# Altium schematic sheet sch_pet.SchDoc
size A4; SheetNumber: 1; SheetTotal: 1
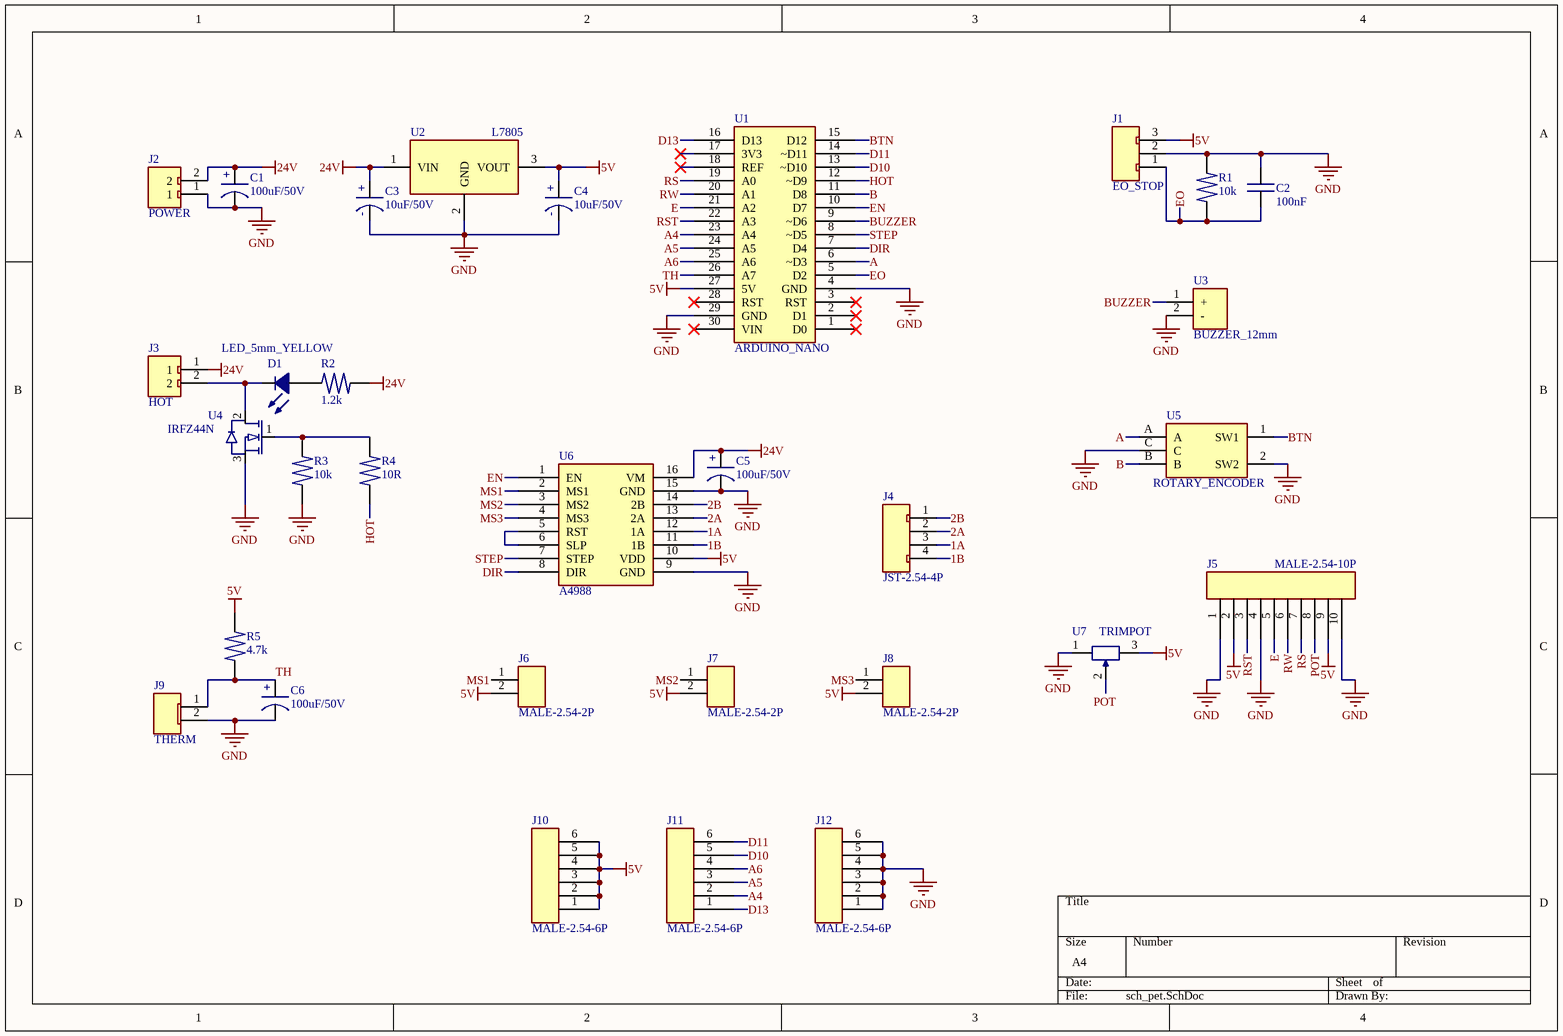
[diagram p0: sch_pet.SchDoc]

## Parts
C1  100uF/50V  [100uF/50V]
C2  100nF  [CAPACITOR 104]
C3  10uF/50V  [10uF/50V]
C4  10uF/50V  [10uF/50V]
C5  100uF/50V  [100uF/50V]
C6  100uF/50V  [100uF/50V]
D1  LED_5mm_YELLOW  [LED_5mm_YELLOW]
J1  EO_STOP  [JST-2.54-3P]
J2  POWER  [BORNE-5.00-2P]
J3  HOT  [BORNE-5.00-2P]
J4  JST-2.54-4P  [JST-2.54-4P]
J5  MALE-2.54-10P  [MALE-2.54-10P]
J6  MALE-2.54-2P  [MALE-2.54-2P]
J7  MALE-2.54-2P  [MALE-2.54-2P]
J8  MALE-2.54-2P  [MALE-2.54-2P]
J9  THERM  [JST-2.54-2P]
J10  MALE-2.54-6P  [MALE-2.54-6P]
J11  MALE-2.54-6P  [MALE-2.54-6P]
J12  MALE-2.54-6P  [MALE-2.54-6P]
R1  10k  [RESISTOR_PTH_9.5mm]
R2  1.2k  [RESISTOR_PTH_9.5mm]
R3  10k  [RESISTOR_PTH_9.5mm]
R4  10R  [RESISTOR_PTH_9.5mm]
R5  4.7k  [RESISTOR_PTH_9.5mm]
U1  ARDUINO_NANO  [ARDUINO_NANO]
U2  L7805  [L7805_180]
U3  BUZZER_12mm  [BUZZER_12mm]
U4  IRFZ44N  [IRFZ44N]
U5  ROTARY_ENCODER  [ROTARY_ENCODER]
U6  A4988  [A4988]
U7  TRIMPOT  [TRIMPOT_1]

## Nets
5V: C4.2 J1.3 J5.2 J5.9 J6.2 J7.2 J8.2 J10.1 J10.2 J10.3 J10.4 J10.5 J10.6 R5.2 U1.27(5V) U2.3(VOUT) U6.10(VDD) U7.3
24V: C1.2 C3.2 C5.2 J2.2 J3.1 R2.2 U2.1(VIN) U6.16(VM)
GND: C1.1 C2.2 C3.1 C4.1 C5.1 C6.1 J1.2 J2.1 J5.1 J5.4 J5.10 J9.2 J12.1 J12.2 J12.3 J12.4 J12.5 J12.6 R1.2 R3.1 U1.4(GND) U1.29(GND) U2.2(GND) U3.2(-) U4.3 U5.2(SW2) U5.C U6.9(GND) U6.15(GND) U7.1
1A: J4.3 U6.12(1A)
1B: J4.4 U6.11(1B)
2A: J4.2 U6.13(2A)
2B: J4.1 U6.14(2B)
A: U1.6(~D3) U5.A
A4: J11.2 U1.23(A4)
A5: J11.3 U1.24(A5)
A6: J11.4 U1.25(A6)
B: U1.11(D8) U5.B
BTN: U1.15(D12) U5.1(SW1)
BUZZER: U1.9(~D6) U3.1(+)
D10: J11.5 U1.13(~D10)
D11: J11.6 U1.14(~D11)
D13: J11.1 U1.16(D13)
DIR: U1.7(D4) U6.8(DIR)
E: J5.5 U1.21(A2)
EN: U1.10(D7) U6.1(EN)
EO: C2.1 J1.1 R1.1 U1.5(D2)
HOT: R4.1 U1.12(~D9)
MS1: J6.1 U6.2(MS1)
MS2: J7.1 U6.3(MS2)
MS3: J8.1 U6.4(MS3)
POT: J5.8 U7.2
RS: J5.7 U1.19(A0)
RST: J5.3 U1.22(A3)
RW: J5.6 U1.20(A1)
STEP: U1.8(~D5) U6.7(STEP)
TH: C6.2 J9.1 R5.1 U1.26(A7)
NetD1_1: D1.1 R2.1
NetD1_2: D1.2 J3.2 U4.2
NetR3_2: R3.2 R4.2 U4.1
NetU6_5: U6.5(RST) U6.6(SLP)

Not connected (* = marked no-connect by the designer): U1 1(D0)* 2(D1)* 3(RST)* 17(3V3)* 18(REF)* 28(RST)* 30(VIN)*

## Notes on the sheet
- (in symbol 10uF/50V) +; -
- (in symbol 100uF/50V) +

## Library data of the parts
C1 C5 C6 = 100uF/50V: Electrolytic Capacitor 100uF/50V
C2 = CAPACITOR 104: Ceramic Capacitor 104, 3mm.
C3 C4 = 10uF/50V: Electrolytic Capacitor 10uF/50V
D1 = LED_5mm_YELLOW: LED PTH 5mm Yellow.
J1 = JST-2.54-3P: Female Connector JST 3 Vias, 2.54mm.
J2 J3 = BORNE-5.00-2P: Borne 2 Vias, Pitch 5mm.; JLCPCB PN: C91153
J4 = JST-2.54-4P: Female Connector JST 4 Vias, 2.54mm.
J5 = MALE-2.54-10P: Male Header Connector 2.54mm 10 Pins.; JLCPCB PN: C492409
J6-J8 = MALE-2.54-2P: Male Header Connector 2.54mm 2 Pins.; JLCPCB PN: C492401
J9 = JST-2.54-2P: Female Connector JST 2 Vias, 2.54mm.
J10-J12 = MALE-2.54-6P: Male Header Connector 2.54mm 6 Pins.; JLCPCB PN: C492405
R1-R5 = RESISTOR_9.5mm: Generic Resistor 9.5mm.
U1 = ARDUINO_NANO: Based on ATmega328P, Clock 16MHz, Flash 32KB, 14 Digital Pins, 8 Analog Pins, 5V, Vin 7-12V.; ComponentLink1Description: Datasheet; ComponentLink1URL: https://ww1.microchip.com/downloads/en/DeviceDoc/Atmel-7810-Automotive-Microcontrollers-ATmega328P_Datasheet.pdf
U2 = L7805: IC REG LINEAR 5V 1.5A TO220AB; ComponentLink1Description: Datasheet; ComponentLink1URL: https://www.mouser.com/datasheet/2/389/l78-1849632.pdf; Mouser PN: 511-L7805CV; Digikey PN: 497-1443-5-ND; JLCPCB PN PTH: C347289; JLCPCB PN SMD: C15077
U3 = BUZZER_12mm: BUZZER MAGNETIC 12MM; Digikey PN: 433-WT-1209T-ND; Mouser PN: 433-WT-1209T-ND; JLCPCB PN: C781866
U4 = IRFZ44N: 55V N-CHANNEL MOSFET TO-220-3; JLCPCB PN: C2586; ComponentLink1Description: Datasheet; ComponentLink1URL: https://www.infineon.com/dgdl/Infineon-IRFZ44N-DataSheet-v01_01-EN.pdf?fileId=5546d462533600a40153563b3a9f220d
U6 = A4988: Module Stepper Motor Driver 8-35V 2A 20x15mm; ComponentLink1Description: Datasheet; ComponentLink1URL: https://www.pololu.com/file/0J450/a4988_DMOS_microstepping_driver_with_translator.pdf
U5 = ROTARY_ENCODER: JLCPCB PN: C143789